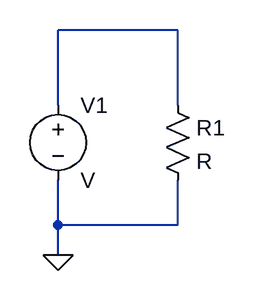
[diagram p0: schematic VERSION_ERROR.asc]
VERSION_ERROR.asc, the LTspice schematic file:
Version 5
SHEET 1 880 680
WIRE 320 16 192 16
WIRE 192 96 192 16
WIRE 320 96 320 16
WIRE 192 224 192 176
WIRE 320 224 320 176
WIRE 320 224 192 224
WIRE 192 256 192 224
FLAG 192 256 0
SYMBOL voltage 192 80 R0
SYMATTR InstName V1
SYMBOL res 304 80 R0
SYMATTR InstName R1

The netlist it stands for:
* VERSION_ERROR.asc
V1 N001 0 V
R1 N001 0 R
.backanno
.end